# Altium schematic sheet TemperatureACQ.SchDoc: TemperatureACQ
size A4; Author: Joao Guimaraes; Organization: Altium Limited; Address1: L3, 12a Rodborough Rd; Address2: Frenchs Forest; Address3: NSW; Address4: Australia 2086; Revision: 1.0
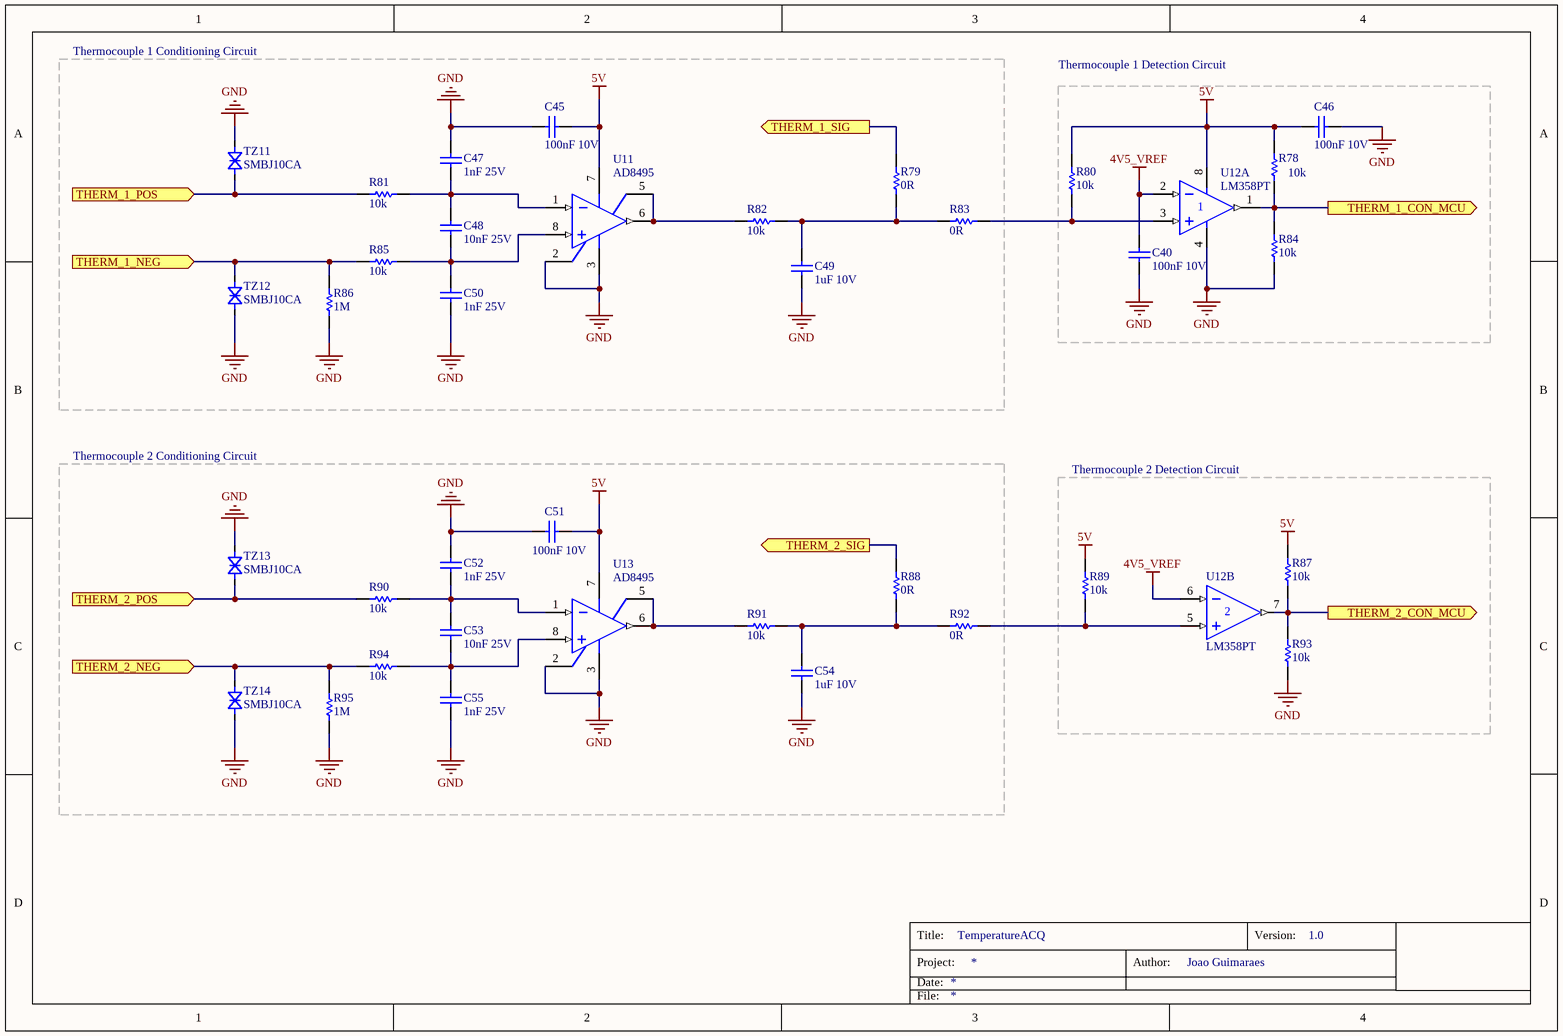
[diagram p0: TemperatureACQ.SchDoc]

## Parts
C40  100nF 10V  [0402]
C45  100nF 10V  [0402]
C46  100nF 10V  [0402]
C47  1nF 25V  [1608[0603]]
C48  10nF 25V  [1608[0603]]
C49  1uF 10V  [C0805]
C50  1nF 25V  [1608[0603]]
C51  100nF 10V  [0402]
C52  1nF 25V  [1608[0603]]
C53  10nF 25V  [1608[0603]]
C54  1uF 10V  [C0805]
C55  1nF 25V  [1608[0603]]
R78  10k  [6-0805_M]
R79  0R  [6-0805_M]
R80  10k  [6-0805_M]
R81  10k  [6-0805_M]
R82  10k  [6-0805_M]
R83  0R  [6-0805_M]
R84  10k  [6-0805_M]
R85  10k  [6-0805_M]
R86  1M  [6-0805_M]
R87  10k  [6-0805_M]
R88  0R  [6-0805_M]
R89  10k  [6-0805_M]
R90  10k  [6-0805_M]
R91  10k  [6-0805_M]
R92  0R  [6-0805_M]
R93  10k  [6-0805_M]
R94  10k  [6-0805_M]
R95  1M  [6-0805_M]
TZ11  SMBJ10CA  [DO-214AA]
TZ12  SMBJ10CA  [DO-214AA]
TZ13  SMBJ10CA  [DO-214AA]
TZ14  SMBJ10CA  [DO-214AA]
U11  AD8495  [RM_8]
U12  LM358PT  [TSOP-8]  (parts A,B of 2)
U13  AD8495  [RM_8]

## Blocks framed on the sheet
Thermocouple 1 Conditioning Circuit: C45 C47-C50 R79 R81-R83 R85 R86 TZ11 TZ12 U11
Thermocouple 1 Detection Circuit: C40 C46 R78 R80 R84 U12
Thermocouple 2 Conditioning Circuit: C51-C55 R88 R90-R92 R94 R95 TZ13 TZ14 U13
Thermocouple 2 Detection Circuit: R87 R89 R93 U12

## Ports
THERM_1_CON_MCU (out), THERM_1_NEG (in), THERM_1_POS (in), THERM_1_SIG (out), THERM_2_CON_MCU (out), THERM_2_NEG (in), THERM_2_POS (in), THERM_2_SIG (out)

## Nets
4V5_VREF: C40.2 U12.2(IN-) U12.6(IN-)
5V: C45.2 C46.2 C51.2 R78.1 R80.1 R87.1 R89.1 U11.7(V+) U12.8(Vs+) U13.7(V+)
GND: C40.1 C45.1 C46.1 C47.2 C49.1 C50.1 C51.1 C52.2 C54.1 C55.1 R84.2 R86.1 R93.2 R95.1 TZ11.2(A) TZ12.1(C) TZ13.2(A) TZ14.1(C) U11.2(REF) U11.3(V-) U12.4(Vs-) U13.2(REF) U13.3(V-)
THERM_1_CON_MCU: R78.2 R84.1 U12.1(OUT) ; port THERM_1_CON_MCU
THERM_1_NEG: R85.1 R86.2 TZ12.2(A) ; port THERM_1_NEG
THERM_1_POS: R81.1 TZ11.1(C) ; port THERM_1_POS
THERM_1_SIG: R79.1 ; port THERM_1_SIG
THERM_2_CON_MCU: R87.2 R93.1 U12.7(OUT) ; port THERM_2_CON_MCU
THERM_2_NEG: R94.1 R95.2 TZ14.2(A) ; port THERM_2_NEG
THERM_2_POS: R90.1 TZ13.1(C) ; port THERM_2_POS
THERM_2_SIG: R88.1 ; port THERM_2_SIG
NetC47_1: C47.1 C48.2 R81.2 U11.1(IN-)
NetC48_1: C48.1 C50.2 R85.2 U11.8(IN+)
NetC49_2: C49.2 R79.2 R82.1 R83.1
NetC52_1: C52.1 C53.2 R90.2 U13.1(IN-)
NetC53_1: C53.1 C55.2 R94.2 U13.8(IN+)
NetC54_2: C54.2 R88.2 R91.1 R92.1
NetR80_2: R80.2 R83.2 U12.3(IN+)
NetR82_2: R82.2 U11.5(SENSE) U11.6(OUT)
NetR89_2: R89.2 R92.2 U12.5(IN+)
NetR91_2: R91.2 U13.5(SENSE) U13.6(OUT)

## Notes on the sheet
- Title:
- Project:
- Date:
- Author:
- Version:
- File:

## Library data of the parts
C40 C45 C46 C51 = Cap: Capacitor; PartNumber: CAP.100n.10V.20%.SMD.0402; Manufacturer: Wurth; ClassName: TemperatureACQ; Price: 0.015; Supplier: Mouser
C47 C55 = Cap: Capacitor; PartNumber: CAP.1n.25V.10%.SMD.0603; Manufacturer: Wurth; ClassName: TemperatureACQ; Price: 0.10; Supplier: Mouser
C48 C53 = Cap: Capacitor; PartNumber: CAP.10n.25V.10%.SMD.0603; Manufacturer: Wurth; ClassName: TemperatureACQ; Price: 0.10; Supplier: Mouser
C49 C54 = Cap: Capacitor; PartNumber: CAP.1u.10V.10%.SMD.0805; Manufacturer: Vishay; ClassName: TemperatureACQ; Price: 0.17; Supplier: Mouser
C50 C52 = Cap: Capacitor; PartNumber: CAP.1n.25V.10%.SMD.0603; Manufacturer: Vishay; ClassName: TemperatureACQ; Price: 0.10; Supplier: Mouser
R78 R81 R82 R84 R85 R87 R90 R91 R93 R94 = Res: Resistor; PartNumber: RES.10K.1/8W.5%.SMD.0805; Manufacturer: Yageo; ClassName: TemperatureACQ; Price: 0.012; Supplier: Mouser
R79 R83 R88 R92 = Res: Resistor; PartNumber: RES.0R.1/8W.5%.SMD.0805; Manufacturer: Vishay; ClassName: TemperatureACQ; Price: 0.044; Supplier: Mouser
R80 R89 = Res: Resistor; PartNumber: RES.10k.1/8W.5%.SMD.0805; Manufacturer: Bourns; ClassName: TemperatureACQ; Price: 0.012; Supplier: Mouser
R86 R95 = Res: Resistor; PartNumber: RES.1M.1/8W.5%.SMD.0805; Manufacturer: Bourns; ClassName: TemperatureACQ; Price: 0.012; Supplier: Mouser
TZ11-TZ14 = SMBJ10CA: ESD Suppressors / TVS Diodes 600W 10.0V; pin to pad: 1>C 2>A; PartNumber: SMBJ10CA-13-F; ClassName: TemperatureACQ; Price: 0.35; Supplier: Mouser; Manufacturer: Diodes
U11 U13 = AD8495: Precision Type K Thermocouple Amplifier with Cold Junction Compensation; PartNumber: AD8495CRMZ-R7; Manufacturer: Analog Devices; ClassName: TemperatureACQ; Price: 10.84; Supplier: Mouser
U12 = LM358PT: Operational Amplifiers - Op Amps Dual Low Power; Manufacturer: STMicroelectronics; ClassName: TemperatureACQ; PartNumber: LM358PT; Price: 0.40; Supplier: Mouser